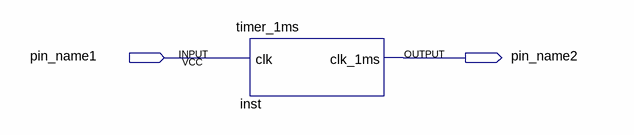
[diagram p0: schematic sheet]
// Quartus schematic Block1.bdf as structural Verilog: 1 symbols, 2 pins
module Block1 (
  input  pin_name1,
  output pin_name2
);

  timer_1ms inst (.clk(pin_name1), .clk_1ms(pin_name2));
endmodule
